# Altium schematic sheet Reset_Pin.SchDoc
size A
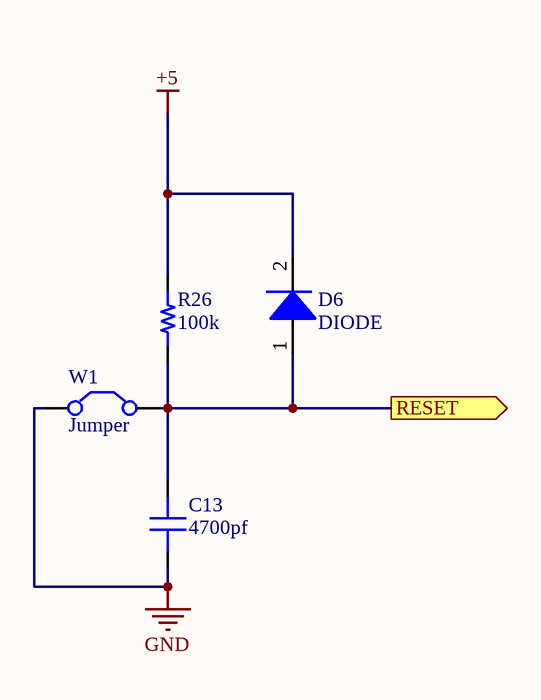
[diagram p0: Reset_Pin.SchDoc]

## Parts
C13  value 4700pf  [CAP 0805/2012]  (hidden comment: Capacitor MLCC 4700pf 25V CAP 0805/2012)
D6  DIODE  [SOD123F]
R26  value 100k  [RES 0805/2012]  (hidden comment: Resistor 100k 0805 1/10W 1%)
W1  Jumper  [XG8T-0231]

## Ports
RESET (out)

## Nets
+5: D6.2(K) R26.2
GND: C13.1 W1.1(C1)
RESET: C13.2 D6.1(A) R26.1 W1.2(C2) ; port RESET

## Library data of the parts
C13 = 689: Manufacturer_id: 1; idCapacitor: 689; Name: Cap_4700pf_25V_CAP 0805/2012; Dielectric: Ceramic; Created_By: Nick Mah; Drawer_id: 1; Voltage_Rating: 25V; Package: CAP 0805/2012; Created_Date: 10/20/2018
D6 = 4: 100V Reverse DC Voltage; Manufacturer_id: 1; idDiode: 4; Name: 1N4148W-7-F; Ic: 300 mA; Drawer_id: 1; Package: SOD123; MfrPartNo: 1N4148W-7-F; Link: https://www.digikey.com/product-detail/en/diodes-incorporated/1N4148W-7-F/1N4148W-FDICT-ND/815280
R26 = 553: Manufacturer_id: 1; idResistor: 553; Name: Res_100k_0805_1/10W_1%; Created_By: Nick Mah; Supplier 1: Digi-Key; Drawer_id: 1; Tolerance: 1%; Power: 1/10W; Package: 0805; ComponentLink1Description: Datasheet; Created_Date: 2018-10-20
W1 = 18: Jumper headers; Manufacturer_id: 1; idFuse: 3; idConn: 18; Num_Contacts: 2; Pitch: .1 mm; Drawer_id: 1; Name: XG8T-0231; Value: Jumper; Num_Rows: 1; MfrPartNo: XG8T-0231; Link: https://www.digikey.ca/product-detail/en/omron-electronics-inc-emc-div/XG8T-0231/XG8T-0231-ND/1829453; ComponentLink1Description: Datasheet; Supplier1: Digi-Key